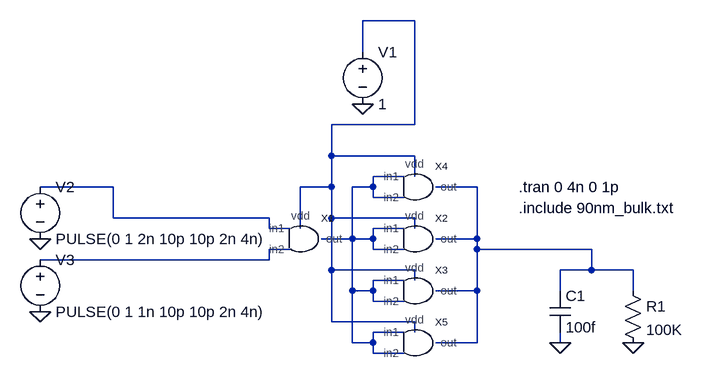
[diagram p0: schematic andParallel-test.asc]
andParallel-test.asc, the LTspice schematic file:
Version 4
SHEET 1 880 680
WIRE 384 -192 304 -192
WIRE 304 -144 304 -192
WIRE 384 -32 384 -192
WIRE 384 -32 256 -32
WIRE 256 16 256 -32
WIRE 384 16 256 16
WIRE 368 48 320 48
WIRE 384 48 384 16
WIRE -80 64 -192 64
WIRE 256 64 256 16
WIRE 256 64 208 64
WIRE 320 64 320 48
WIRE 320 64 288 64
WIRE 480 64 416 64
WIRE 320 80 320 64
WIRE 368 80 320 80
WIRE -80 112 -80 64
WIRE 160 112 -80 112
WIRE 256 112 256 64
WIRE 384 112 256 112
WIRE 160 128 160 112
WIRE 192 128 160 128
WIRE 208 128 208 64
WIRE 368 128 320 128
WIRE 384 128 384 112
WIRE 288 144 288 64
WIRE 288 144 240 144
WIRE 320 144 320 128
WIRE 320 144 288 144
WIRE 480 144 480 64
WIRE 480 144 416 144
WIRE 192 160 160 160
WIRE 320 160 320 144
WIRE 368 160 320 160
WIRE 480 160 480 144
WIRE 656 160 480 160
WIRE 160 176 160 160
WIRE 160 176 -192 176
WIRE 256 192 256 112
WIRE 384 192 256 192
WIRE 656 192 656 160
WIRE 656 192 608 192
WIRE 720 192 656 192
WIRE 368 208 320 208
WIRE 384 208 384 192
WIRE 288 224 288 144
WIRE 320 224 320 208
WIRE 320 224 288 224
WIRE 480 224 480 160
WIRE 480 224 416 224
WIRE 608 224 608 192
WIRE 720 224 720 192
WIRE 320 240 320 224
WIRE 368 240 320 240
WIRE 256 272 256 192
WIRE 384 272 256 272
WIRE 368 288 320 288
WIRE 384 288 384 272
WIRE 288 304 288 224
WIRE 320 304 320 288
WIRE 320 304 288 304
WIRE 480 304 480 224
WIRE 480 304 416 304
WIRE 608 304 608 288
WIRE 320 320 320 304
WIRE 368 320 320 320
FLAG 304 -64 0
FLAG 608 304 0
FLAG 720 304 0
FLAG -192 144 0
FLAG -192 256 0
SYMBOL voltage 304 -160 R0
WINDOW 123 0 0 Left 2
WINDOW 39 0 0 Left 2
SYMATTR InstName V1
SYMATTR Value 1
SYMBOL voltage -192 48 R0
WINDOW 123 0 0 Left 2
WINDOW 39 0 0 Left 2
SYMATTR InstName V2
SYMATTR Value PULSE(0 1 2n 10p 10p 2n 4n)
SYMBOL res 704 208 R0
SYMATTR InstName R1
SYMATTR Value 100K
SYMBOL cap 592 224 R0
SYMATTR InstName C1
SYMATTR Value 100f
SYMBOL voltage -192 160 R0
WINDOW 123 0 0 Left 2
WINDOW 39 0 0 Left 2
SYMATTR InstName V3
SYMATTR Value PULSE(0 1 1n 10p 10p 2n 4n)
SYMBOL and 208 144 R0
SYMATTR InstName X1
SYMBOL and 384 144 R0
SYMATTR InstName X2
SYMBOL and 384 224 R0
SYMATTR InstName X3
SYMBOL and 384 64 R0
SYMATTR InstName X4
SYMBOL and 384 304 R0
SYMATTR InstName X5
TEXT 544 64 Left 2 !.tran 0 4n 0 1p
TEXT 544 96 Left 2 !.include 90nm_bulk.txt

The netlist it stands for:
* andParallel-test.asc
V1 N001 0 1
V2 N003 0 PULSE(0 1 2n 10p 10p 2n 4n)
R1 N004 0 100K
C1 N004 0 100f
V3 N005 0 PULSE(0 1 1n 10p 10p 2n 4n)
XX1 N003 N005 N001 N002 and  ; pins in1 in2 vdd out
XX2 N002 N002 N001 N004 and  ; pins in1 in2 vdd out
XX3 N002 N002 N001 N004 and  ; pins in1 in2 vdd out
XX4 N002 N002 N001 N004 and  ; pins in1 in2 vdd out
XX5 N002 N002 N001 N004 and  ; pins in1 in2 vdd out
.tran 0 4n 0 1p
.include 90nm_bulk.txt
.backanno
.end